# EAGLE design SegmentDisplay (EAGLE 9.2.2)
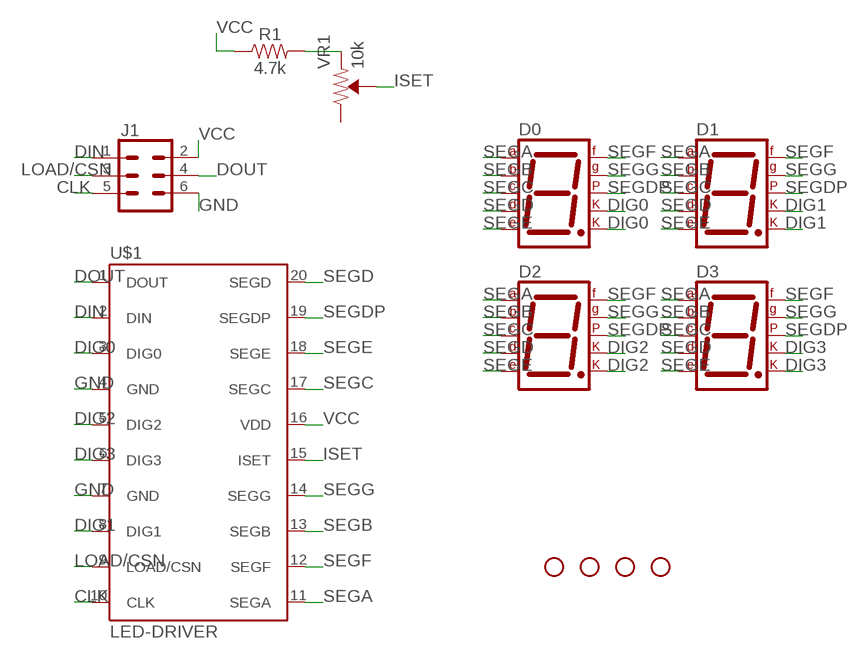
[diagram p0: schematic, sheet 1]

## Parts
D0  7SEG-CK  [7SEG-13]
D1  7SEG-CK  [7SEG-13]
D2  7SEG-CK  [7SEG-13]
D3  7SEG-CK  [7SEG-13]
H1  STAND-OFF  [STAND-OFF]
H2  STAND-OFF  [STAND-OFF]
H3  STAND-OFF  [STAND-OFF]
H4  STAND-OFF  [STAND-OFF]
J1  CONN_03X2NO_SILK  [2X3-NS]
R1  4.7k  4.7KOHM-0603-1/10W-1%  [0603]
U$1  LED-DRIVER  LED-DRIVERAS1108LED-DRIVER-SOIC  [SOIC20L]
VR1  10k  TRIMPOT-PTH-10MM-KNOB-1/2W-10%  [TRIMPOT-PTH-3386U]

## Nets
CLK: J1.5 U$1.10(CLK)
DIG0: D0.3(CK1) D0.8(CK2) U$1.3(DIG0)
DIG1: D1.3(CK1) D1.8(CK2) U$1.8(DIG1)
DIG2: D2.3(CK1) D2.8(CK2) U$1.5(DIG2)
DIG3: D3.3(CK1) D3.8(CK2) U$1.6(DIG3)
DIN: J1.1 U$1.2(DIN)
DOUT: J1.4 U$1.1(DOUT)
GND: J1.6 U$1.4(GND) U$1.7(GND)
ISET: U$1.15(ISET) VR1.2(WIPER)
LOAD/CSN: J1.3 U$1.9(LOAD/CSN)
N$2: R1.2 VR1.1(CCW)
SEGA: D0.7(A) D1.7(A) D2.7(A) D3.7(A) U$1.11(SEGA)
SEGB: D0.6(B) D1.6(B) D2.6(B) D3.6(B) U$1.13(SEGB)
SEGC: D0.4(C) D1.4(C) D2.4(C) D3.4(C) U$1.17(SEGC)
SEGD: D0.2(D) D1.2(D) D2.2(D) D3.2(D) U$1.20(SEGD)
SEGDP: D0.5(DP) D1.5(DP) D2.5(DP) D3.5(DP) U$1.19(SEGDP)
SEGE: D0.1(E) D1.1(E) D2.1(E) D3.1(E) U$1.18(SEGE)
SEGF: D0.9(F) D1.9(F) D2.9(F) D3.9(F) U$1.12(SEGF)
SEGG: D0.10(G) D1.10(G) D2.10(G) D3.10(G) U$1.14(SEGG)
VCC: J1.2 R1.1 U$1.16(VDD)
Unconnected: VR1.3(CW)

## Library data of the parts
D0 D1-D3 = special:7SEG-CK: 7-segment DISPLAY single cathode, 13 mm
H1-H4 = SparkFun-Hardware:STAND-OFF: Stand Off Drill holes for mechanically mounting via screws, standoffs, etc. Note: Use the keepout ring to avoid running the screw head into surrounding components. Variant Overviews STAND-OFF - Mechanical footprint for a #4 phillips button head screw. STAND-OFF-TIGHT - Mechanical footprint for a #4 phillips button head screw, Example SparkFun Products Screw - Phillips Head (1/4", 4-40, 10 pack) <https://www.sparkfun.com/products/10453> (PRT-10453) Screw - Phillips Head (1/2", 4-40, 10 pack) <https://www.sparkfun.com/products/10452> (PRT-10452) Screw - Phillips Head (3/4", 4-40, 10 pack) <https://www.sparkfun.com/products/10451> (PRT-10451) Screw - Phillips Head (1", 4-40, 10 pack) <https://www.sparkfun.com/products/10450> (PRT-10450)
J1 = SparkFun-Connectors:CONN_03X2: Multi connection point. Often used as Generic Header-pin footprint for 0.1 inch spaced/style header connections You can populate with any combo of single row headers, but if you'd like an exact match, check these: Header - 2x3 (Male, 0.1") <https://www.sparkfun.com/products/12807> (PRT-12807) Header - 2x3 (Female, 0.1") <https://www.sparkfun.com/products/13010> (PRT-13010) 2x3 Pin Shrouded Header <https://www.sparkfun.com/products/10877> (PRT-10877) On any of the 0.1 inch spaced packages, you can populate with these: Break Away Headers - Straight <https://www.sparkfun.com/products/116> (PRT-00116) Break Away Male Headers - Right Angle <https://www.sparkfun.com/products/553> (PRT-00553) Female Headers <https://www.sparkfun.com/products/115> (PRT-00115) Break Away Headers - Machine Pin <https://www.sparkfun.com/products/117> (PRT-00117) Break Away Female Headers - Swiss Machine Pin <https://www.sparkfun.com/products/743> (PRT-00743) Special note: the shrouded connector mates well with our 3x2 ribbon cables: Ribbon Crimp Connector - 6-pin (2x3, Female) <https://www.sparkfun.com/products/10651> (PRT-10651) Ribbon Cable - 6 wire (15ft) <https://www.sparkfun.com/products/10646> (PRT-10646)
R1 = SparkFun-Resistors:4.7KOHM: 4.7kΩ resistor A resistor is a passive two-terminal electrical component that implements electrical resistance as a circuit element. Resistors act to reduce current flow, and, at the same time, act to lower voltage levels within circuits. - Wikipedia; PROD_ID: RES-07857
U$1 = led-driver-soic:LED-DRIVERAS1108
VR1 = SparkFun-Resistors:TRIMPOT: Trimming Potentiometer (Trimpot) Three-terminal potentiometers, with an adjustable wiper and two adjustable resistors. A pot can be used to create a configurable voltage divider, or as a variable resistor. "Trimpots" are a subset of potentiometers, usually intended for "set-and-forget" applications. They're often more delicate than standard potentiometers - rated for fewer turns. Variants PTH-KNOB - PTH Trimpot w/ finger-adjustable knob Trimpot 10K with Knob <https://www.sparkfun.com/products/9806> (COM-09806) Datasheet <http://www.sparkfun.com/datasheets/Components/General/TSR-3386.pdf> SMD-3MM-CLOSED-FRAME - SMD 3mm Square Closed-Frame Trimpot Used on e.g. EasyDriver - Stepper Motor Driver <https://www.sparkfun.com/products/12779> Datasheet <http://www.bitechnologies.com/pdfs/22.pdf> (22AR10KTR) SMD-5MM - SMD 5mm Square Closed-Frame Trimpot Used on e.g. IOIO-OTG - V2.2 <https://www.sparkfun.com/products/13613> Datasheet <http://www.vishay.com/docs/51008/ts53.pdf> (TS53YL502MR10) SMD-3MM-1/10W-25% - 3mm Square Open-Frame Trimpot Used on e.g. SparkFun Shapeoko <https://www.sparkfun.com/products/13899> Datasheet <http://www.bourns.com/docs/Product-Datasheets/TC33.pdf> (TC33X-2-103E); PROD_ID: RES-09730; SF_SKU: COM-09806

## Board
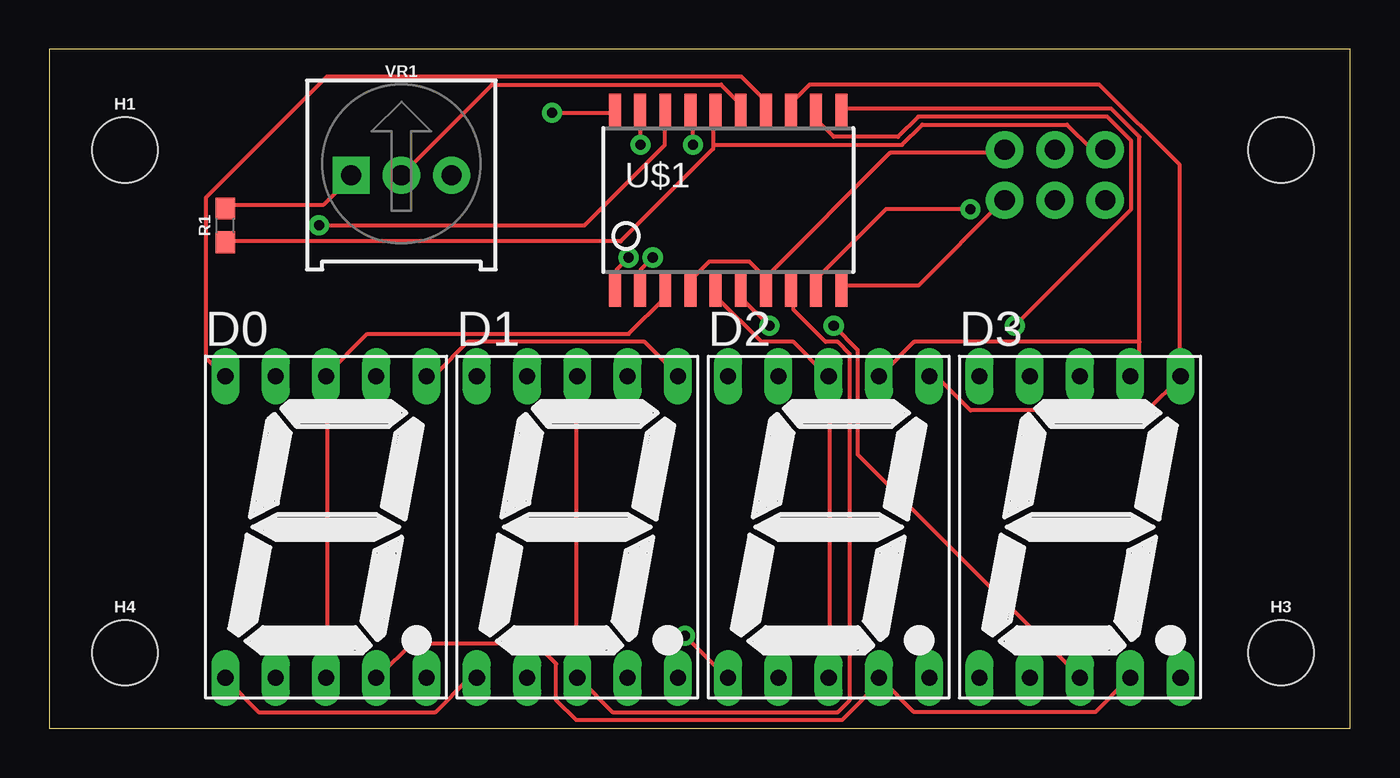
[diagram p1: board, top side]
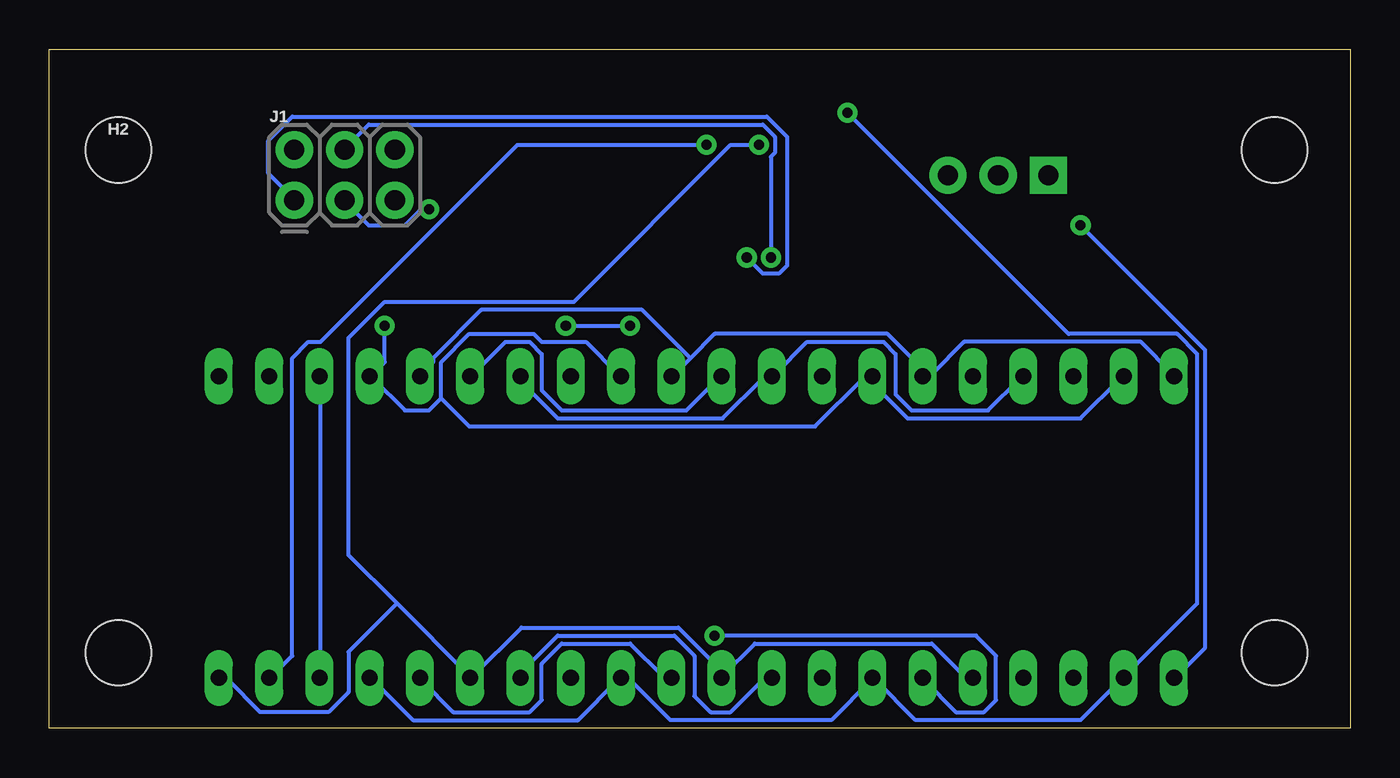
[diagram p2: board, bottom side, seen from below]

Size 65.71 x 34.28 mm. Coordinates in mm from the lower left corner, seen from the top.
Outline: 0,0 65.71,0 65.71,34.28 0,34.28 0,0
Copper layers (1*16): Top 0.035mm / dielectric 1.5mm / Bottom 0.035mm
Design rules "SparkFun": minimum track width 8mil, minimum drill 20mil, track to track 8mil, track to pad 8mil, pad to pad 8mil, via to via 8mil, smd to smd 8mil, copper to edge 8mil, drill to drill 8mil, minimum pad ring 12mil, minimum via ring 10mil, stop-mask expansion 4mil, vias tented up to drill 20mil, thermal gap 10mil

### Footprints (pad centres in the part's own frame; a part is rotated, then mirrored left to right if it is on the bottom)
7SEG-13 = drill 0.813 long: 1 -5.08,-7.62; 2 -2.54,-7.62; 3 0,-7.62; 4 2.54,-7.62; 5 5.08,-7.62; 6 5.08,7.62; 7 2.54,7.62; 8 0,7.62; 9 -2.54,7.62; 10 -5.08,7.62
STAND-OFF = hole 3.302: 0,0
2X3-NS = drill 1.016 pad 1.88: 1 -2.54,-1.27; 2 -2.54,1.27; 3 0,-1.27; 4 0,1.27; 5 2.54,-1.27; 6 2.54,1.27
0603 = smd 1.1 x 1: 1 -0.85,0; 2 0.85,0
SOIC20L = smd 0.6 x 1.8: 1 -5.715,-4.475; 2 -4.445,-4.475; 3 -3.175,-4.475; 4 -1.905,-4.475; 5 -0.635,-4.475; 6 0.635,-4.475; 7 1.905,-4.475; 8 3.175,-4.475; 9 4.445,-4.475; 10 5.715,-4.475; 11 5.715,4.475; 12 4.445,4.475; 13 3.175,4.475; 14 1.905,4.475; 15 0.635,4.475; 16 -0.635,4.475; 17 -1.905,4.475; 18 -3.175,4.475; 19 -4.445,4.475; 20 -5.715,4.475
TRIMPOT-PTH-3386U = drill 1.016 pad 1.88 square: 1 -2.54,-0.015 | drill 1.016 pad 1.88: 2 0,-0.015; 3 2.54,-0.015

### Placement (x,y rotation side)
D0  13.97,10.16 0 top
D1  26.67,10.16 0 top
D2  39.37,10.16 0 top
D3  52.07,10.16 0 top
H1  3.81,29.21 0 top
H2  62.23,29.21 0 top
H3  62.23,3.81 0 top
H4  3.81,3.81 0 top
J1  50.8,27.94 0 bottom
R1  8.89,25.4 90 top
U$1  34.29,26.67 0 top
VR1  17.78,27.94 0 top

### Tracks (layer width: path | path; a pad name or v marks a point on that pad's centre or on a via)
CLK
  Top 0.203: U$1.10 40.03,22.35 43.89,22.35 48.16,26.62 J1.5
DIG0
  Top 0.203: U$1.3 31.09,22.15 31.09,21.74 29.26,19.91 16.05,19.91 14.02,17.88 D0.8 14.02,17.68 14.02,2.64 D0.3
DIG1
  Top 0.203: U$1.8 37.59,22.15 37.59,21.13 39.22,19.51 39.83,19.51 40.44,18.9 40.44,1.42 39.83,0.81 28.45,0.81 26.82,2.44 D1.3 26.62,2.64 26.62,17.68 D1.8
DIG2
  Top 0.203: U$1.5 33.73,22.15 33.73,21.74 35.97,19.51 37.59,19.51 39.22,17.88 D2.8 39.42,17.68 39.42,2.64 D2.3
DIG3  (via drill 0.51)
  Top 0.203: v36.37,20.32 34.95,21.74 34.95,22.15 U$1.6 | v39.62,20.32 40.84,19.1 40.84,13.82 52.02,2.64 D3.3
  Bottom 0.203: v39.62,20.32 v36.37,20.32 | D3.8 52.02,17.68 52.02,2.64 D3.3
DIN  (via drill 0.51)
  Top 0.203: v30.48,23.77 29.87,23.16 29.87,22.35 U$1.2
  Bottom 0.203: v30.48,23.77 29.67,22.96 28.85,22.96 28.45,23.37 28.45,29.87 29.46,30.89 53.44,30.89 54.66,29.67 54.66,28.04 53.44,26.82 J1.1
DOUT  (via drill 0.51)
  Top 0.203: v29.26,23.77 28.65,23.16 28.65,22.35 U$1.1
  Bottom 0.203: v29.26,23.77 29.26,28.85 29.06,29.06 29.06,29.87 29.67,30.48 49.58,30.48 50.8,29.26 J1.4
GND
  Top 0.203: 36.17,22.76 35.36,23.57 33.33,23.57 32.51,22.76 32.51,22.35 U$1.4 | 36.17,22.76 36.17,22.35 U$1.7 36.17,22.76 | 36.17,22.76 42.47,29.06 48.16,29.06 J1.6
ISET
  Top 0.203: U$1.15 34.75,31.29 34.75,31.7 33.93,32.51 22.35,32.51 17.88,28.04 VR1.2
LOAD/CSN  (via drill 0.51)
  Top 0.203: v46.53,26.21 42.27,26.21 38.81,22.76 38.81,22.35 U$1.9
  Bottom 0.203: v46.53,26.21 46.94,26.21 47.75,25.4 49.58,25.4 50.8,26.62 J1.3
N$2
  Top 0.203: R1.2 8.94,26.42 13.82,26.42 15.24,27.84 VR1.1
SEGA
  Top 0.203: 55.07,19.51 55.07,18.29 54.66,17.88 D3.7 | 55.07,19.51 55.07,29.87 53.65,31.29 40.03,31.29 U$1.11 | 55.07,19.51 43.69,19.51 42.06,17.88 D2.7
  Bottom 0.203: D0.7 16.66,17.68 18.29,16.05 22.15,16.05 22.96,16.87 22.96,18.9 23.57,19.51 27.43,19.51 29.06,17.88 D1.7 29.26,17.68 29.67,17.68 31.7,15.65 40.03,15.65 42.06,17.68 D2.7
SEGB
  Top 0.203: D0.6 19.1,17.88 19.51,17.88 21.13,19.51 30.07,19.51 31.7,17.88 D1.6 | U$1.13 37.59,31.29 37.59,31.7 38.41,32.51 53.03,32.51 57.1,28.45 57.1,17.88 D3.6 57.1,17.68 55.47,16.05 46.53,16.05 44.91,17.68 44.5,17.68 D2.6
  Bottom 0.203: D1.6 31.9,17.68 33.53,16.05 39.83,16.05 40.84,17.07 40.84,18.9 41.45,19.51 42.67,19.51 44.3,17.88 D2.6
SEGC  (via drill 0.51)
  Top 0.203: 42.06,2.44 40.03,0.41 26.62,0.41 25.6,1.42 25.6,3.25 24.59,4.27 18.29,4.27 16.66,2.64 D0.4 | v32.51,29.46 32.51,31.09 U$1.17 | 42.06,2.44 43.69,0.81 52.83,0.81 54.46,2.44 D3.4 | 42.06,2.44 D2.4
  Bottom 0.203: D1.4 29.26,2.44 29.67,2.44 31.29,0.81 32.31,0.81 33.12,1.63 33.12,3.66 34.14,4.67 40.03,4.67 42.06,2.64 D2.4 | v32.51,29.46 42.06,29.46 52.02,19.51 52.63,19.51 53.44,18.69 53.44,3.66 54.46,2.64 D3.4
SEGD  (via drill 0.51)
  Top 0.203: v25.4,31.09 28.45,31.09 U$1.20
  Bottom 0.203: D3.2 49.38,2.44 47.35,0.41 39.01,0.41 36.98,2.44 D2.2 36.78,2.44 36.37,2.44 34.34,0.41 26.21,0.41 24.18,2.44 D1.2 23.98,2.44 21.95,0.41 13.61,0.41 11.58,2.44 D0.2 11.38,2.64 7.72,6.3 7.72,18.9 8.74,19.91 14.22,19.91 v25.4,31.09
SEGDP  (via drill 0.51)
  Top 0.203: v29.87,29.46 29.87,31.09 U$1.19
  Bottom 0.203: D0.5 19.1,2.64 19.51,2.64 21.13,4.27 30.07,4.27 31.7,2.64 D1.5 31.9,2.64 31.9,3.05 33.93,5.08 41.86,5.08 44.3,2.64 D2.5 44.5,2.64 48.16,6.3 | v29.87,29.46 31.29,29.46 39.22,21.54 48.77,21.54 50.6,19.71 50.6,8.74 48.16,6.3 | 48.16,6.3 50.6,3.86 50.6,1.83 51.61,0.81 55.07,0.81 56.69,2.44 57.1,2.44 D3.5
SEGE  (via drill 0.51)
  Top 0.203: v13.61,25.4 27.03,25.4 31.09,29.46 31.09,31.09 U$1.18 | D1.1 21.54,2.44 21.13,2.44 19.51,0.81 10.57,0.81 8.94,2.44 D0.1 | v32.11,4.67 34.14,2.64 D2.1
  Bottom 0.203: D2.1 34.34,2.64 34.75,2.64 36.37,4.27 39.83,4.27 40.84,3.25 40.84,1.42 41.45,0.81 45.31,0.81 46.94,2.44 D3.1 | v13.61,25.4 7.32,19.1 7.32,4.06 8.74,2.64 D0.1 | v32.11,4.67 18.9,4.67 17.88,3.66 17.88,1.42 18.49,0.81 19.91,0.81 21.54,2.44 D1.1
SEGF  (via drill 0.51)
  Top 0.203: v48.77,20.32 54.66,26.21 54.66,29.67 53.44,30.89 43.89,30.89 42.88,29.87 39.62,29.87 38.81,30.68 38.81,31.09 U$1.12
  Bottom 0.203: D0.9 11.58,17.68 13.61,15.65 22.35,15.65 23.98,17.27 23.98,17.68 D1.9 24.18,17.68 24.59,17.68 27.03,15.24 44.5,15.24 45.92,16.66 | v48.77,20.32 48.77,18.49 49.38,17.88 D3.9 49.38,17.68 47.75,16.05 46.53,16.05 45.92,16.66 | 45.92,16.66 45.92,18.49 44.5,19.91 41.25,19.91 40.84,19.51 38.61,19.51 36.98,17.88 D2.9
SEGG
  Top 0.203: U$1.14 36.17,31.29 36.17,31.7 34.95,32.92 14.02,32.92 7.92,26.82 7.92,18.69 8.74,17.88 D0.10
  Bottom 0.203: 21.34,17.88 21.13,17.88 19.51,19.51 10.57,19.51 8.94,17.88 D0.10 | 21.34,17.88 21.54,17.88 D1.10 21.34,17.88 | 33.33,18.69 32.11,19.91 23.37,19.91 21.34,17.88 | 33.33,18.69 34.14,17.88 D2.10 | 33.33,18.69 35.76,21.13 43.89,21.13 46.33,18.69 46.33,18.49 46.94,17.88 D3.10
VCC
  Top 0.203: 33.53,29.46 33.53,31.09 U$1.16 | 33.53,29.46 33.53,29.26 28.85,24.59 8.94,24.59 R1.1 | 33.53,29.46 43.08,29.46 44.09,30.48 51.41,30.48 52.63,29.26 53.24,29.26 J1.2